# EAGLE design PILockbox_Zak_Jan_2016 (EAGLE 7.4.0)
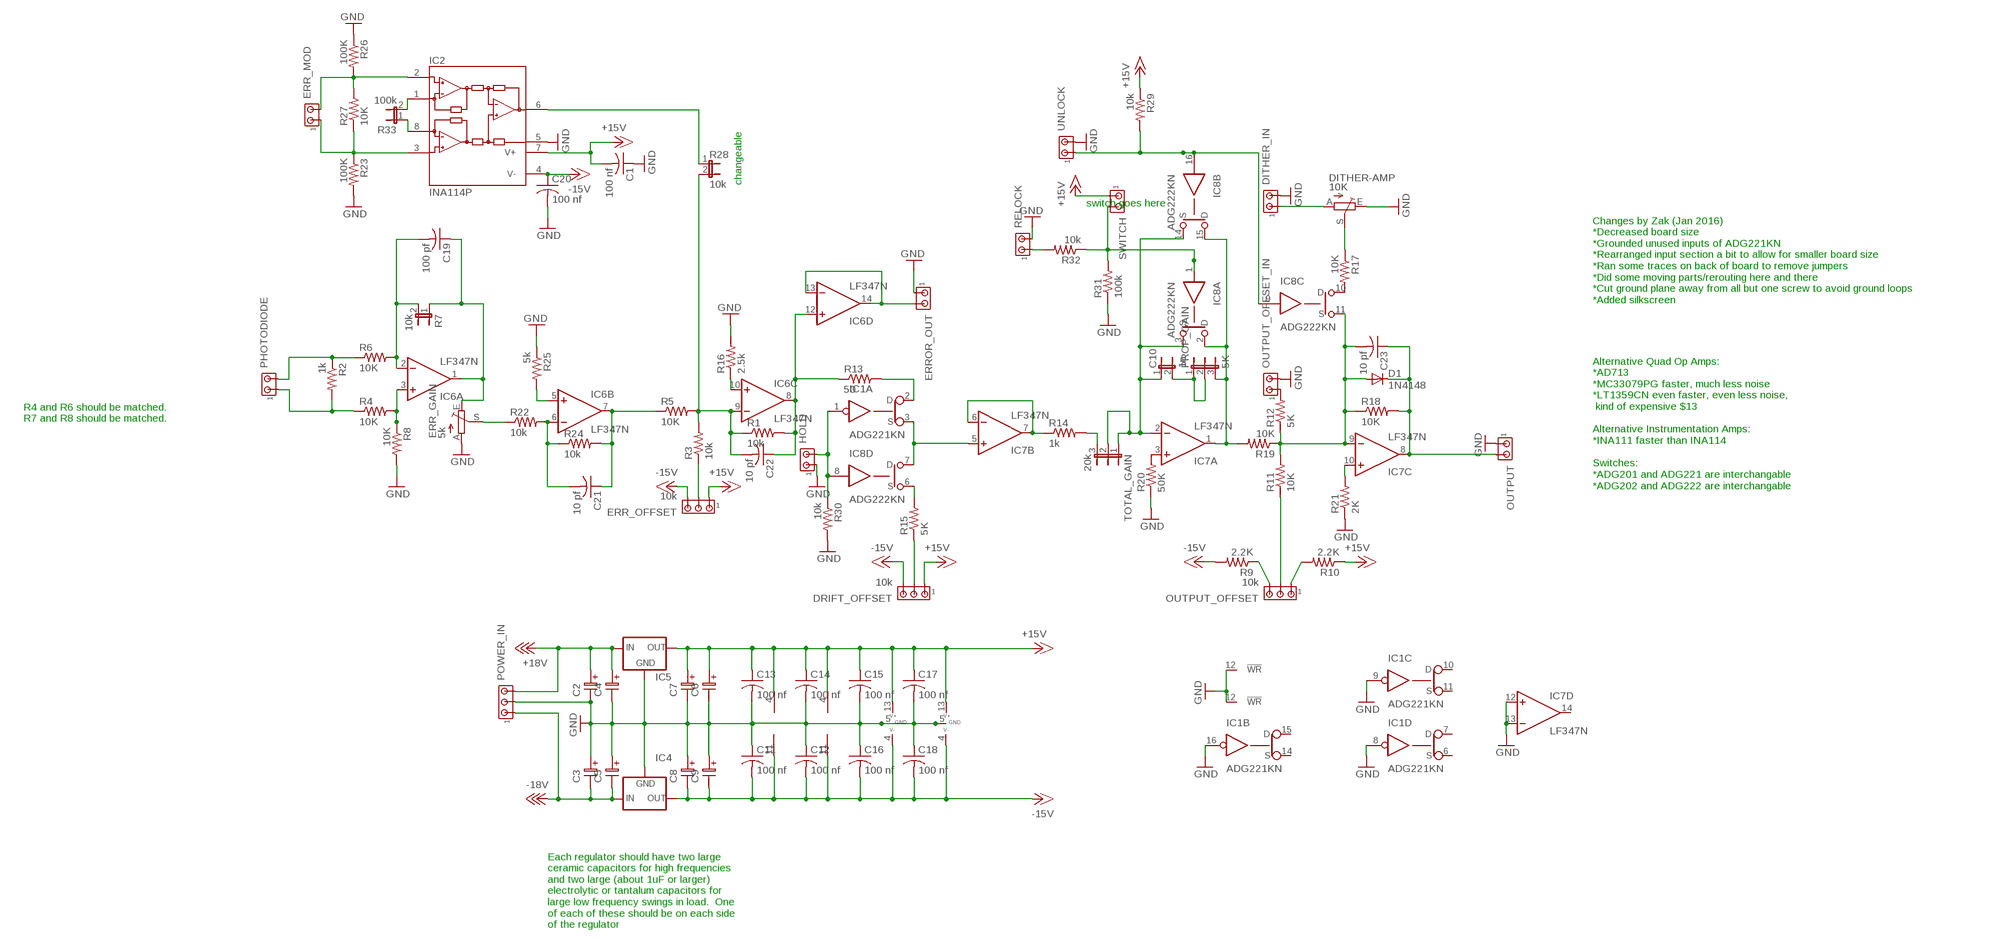
[diagram p0: schematic, sheet 1]

## Parts
C1  100 nf  C-USC0805  [C0805]
C2  ELC-2,5  [ES-2,5]
C3  ELC-2,5  [ES-2,5]
C4  ELC-2,5  [ES-2,5]
C5  ELC-2,5  [ES-2,5]
C6  ELC-2,5  [ES-2,5]
C7  ELC-2,5  [ES-2,5]
C8  ELC-2,5  [ES-2,5]
C9  ELC-2,5  [ES-2,5]
C10  1n  JP1E  [JP1]
C11  100 nf  C-USC0805  [C0805]
C12  100 nf  C-USC0805  [C0805]
C13  100 nf  C-USC0805  [C0805]
C14  100 nf  C-USC0805  [C0805]
C15  100 nf  C-USC0805  [C0805]
C16  100 nf  C-USC0805  [C0805]
C17  100 nf  C-USC0805  [C0805]
C18  100 nf  C-USC0805  [C0805]
C19  100 pf  C-USC0805  [C0805]
C20  100 nf  C-USC0805  [C0805]
C21  10 pf  C-USC0805  [C0805]
C22  10 pf  C-USC0805  [C0805]
C23  10 pf  C-USC0805  [C0805]
D1  1N4148  [DO35-10]
DITHER-AMP  10K  TRIM_EU-RJ9W  [RJ9W]
DITHER_IN  MTA02-100  [10X02MTA]
DRIFT_OFFSET  10k  MTA03-100  [10X03MTA]
ERR_GAIN  5k  TRIM_EU-RJ9W  [RJ9W]
ERR_MOD  MTA02-100  [10X02MTA]
ERR_OFFSET  10k  MTA03-100  [10X03MTA]
ERROR_OUT  MTA02-100  [10X02MTA]
HOLD  MTA02-100  [10X02MTA]
IC1  ADG221KN  [DIL16]
IC2  INA114P  [DIL08]
IC4  79XXL  [79XXL]
IC5  78XXL  [78XXL]
IC6  LF347N  [DIL14]
IC7  LF347N  [DIL14]
IC8  ADG222KN  [DIL16]
OUTPUT  MTA02-100  [10X02MTA]
OUTPUT_OFFSET  10k  MTA03-100  [10X03MTA]
OUTPUT_OFFSET_IN  MTA02-100  [10X02MTA]
PHOTODIODE  MTA02-100  [10X02MTA]
POWER_IN  MTA03-100  [10X03MTA]
PROP_GAIN  5K  JP2E  [JP2]
R1  10k  R-US_R1206  [R1206]
R2  1k  R-US_R1206  [R1206]
R3  10k  R-US_R1206  [R1206]
R4  10K  R-US_R1206  [R1206]
R5  10K  R-US_R1206  [R1206]
R6  10K  R-US_R1206  [R1206]
R7  10k  JP1E  [JP1]
R8  10K  R-US_R1206  [R1206]
R9  2.2K  R-US_R1206  [R1206]
R10  2.2K  R-US_R1206  [R1206]
R11  10K  R-US_R1206  [R1206]
R12  5K  R-US_R1206  [R1206]
R13  50  R-US_R1206  [R1206]
R14  1k  R-US_R1206  [R1206]
R15  5K  R-US_R1206  [R1206]
R16  2.5k  R-US_R1206  [R1206]
R17  10K  R-US_R1206  [R1206]
R18  10K  R-US_R1206  [R1206]
R19  10K  R-US_R1206  [R1206]
R20  50K  R-US_R1206  [R1206]
R21  2K  R-US_R1206  [R1206]
R22  10k  R-US_R1206  [R1206]
R23  100K  R-US_R1206  [R1206]
R24  10k  R-US_R1206  [R1206]
R25  5k  R-US_R1206  [R1206]
R26  100K  R-US_R1206  [R1206]
R27  10K  R-US_R1206  [R1206]
R28  10k  JP1E  [JP1]
R29  10k  R-US_R1206  [R1206]
R30  10k  R-US_R1206  [R1206]
R31  100k  R-US_R1206  [R1206]
R32  10k  R-US_R1206  [R1206]
R33  100k  JP1E  [JP1]
RELOCK  MTA02-100  [10X02MTA]
SWITCH  MTA02-100  [10X02MTA]
TOTAL_GAIN  20k  JP2E  [JP2]
UNLOCK  MTA02-100  [10X02MTA]

## Nets
+15V [+15V]: C1.2 C6.1 C7.1 C13.1 C14.1 C15.1 C17.1 DRIFT_OFFSET.1 ERR_OFFSET.1 IC1.13(P:V+) IC2.7(V+) IC5.OUT IC6.4(P:V+) IC7.4(P:V+) IC8.13(P:V+) R10.1 R29.1 SWITCH.1
+18V [+18V]: C2.1 C4.1 IC5.IN POWER_IN.3
-15V [-15V]: C8.2 C9.2 C11.2 C12.2 C16.2 C18.2 C20.1 DRIFT_OFFSET.3 ERR_OFFSET.3 IC1.4(P:V-) IC2.4(V-) IC4.OUT IC6.11(P:V-) IC7.11(P:V-) IC8.4(P:V-) R9.2
-18V [-18V]: C3.2 C5.2 IC4.IN POWER_IN.1
GND [GND]: C1.1 C2.2 C3.1 C4.2 C5.1 C6.2 C7.2 C8.1 C9.1 C11.1 C12.1 C13.2 C14.2 C15.2 C16.1 C17.2 C18.1 C20.2 DITHER-AMP.E DITHER_IN.2 ERR_GAIN.A ERROR_OUT.1 HOLD.1 IC1.5(P:GND) IC1.8(D:IN) IC1.9(C:IN) IC1.12(\WR:!WR) IC1.16(B:IN) IC2.5(REF) IC4.GND IC5.GND IC7.12(D:+IN) IC7.13(D:-IN) IC8.5(P:GND) IC8.12(\WR:!WR) OUTPUT.1 OUTPUT_OFFSET_IN.2 POWER_IN.2 R8.2 R16.2 R20.1 R21.1 R23.2 R25.1 R26.1 R30.2 R31.1 RELOCK.2 UNLOCK.2
N$1: IC6.3(A:+IN) R4.2 R8.1
N$2: C19.2 IC6.2(A:-IN) R6.2 R7.2
N$3: IC6.10(C:+IN) R16.1
N$4: ERROR_OUT.2 IC6.13(D:-IN) IC6.14(D:OUT)
N$5: PHOTODIODE.2 R2.1 R6.1
N$6: PHOTODIODE.1 R2.2 R4.1
N$7: C19.1 ERR_GAIN.E IC6.1(A:OUT) R7.1
N$8: IC1.3(A:S) IC7.5(B:+IN) IC8.7(D:D)
N$9: C22.2 IC6.9(C:-IN) R1.1 R3.2 R5.2 R28.2
N$10: ERR_OFFSET.2 R3.1
N$11: C22.1 IC6.8(C:OUT) IC6.12(D:+IN) R1.2 R13.1
N$12: IC1.2(A:D) R13.2
N$13: HOLD.2 IC1.1(A:IN) IC8.8(D:IN) R30.1
N$14: DRIFT_OFFSET.2 R15.1
N$15: IC8.6(D:S) R15.2
N$16: IC7.6(B:-IN) IC7.7(B:OUT) R14.1
N$17: R14.2 TOTAL_GAIN.3
N$18: C10.1 IC7.2(A:-IN) IC8.3(A:S) IC8.14(B:S) TOTAL_GAIN.1 TOTAL_GAIN.2
N$19: IC7.3(A:+IN) R20.2
N$20: C10.2 PROP_GAIN.1 PROP_GAIN.2
N$21: IC7.1(A:OUT) IC8.2(A:D) IC8.15(B:D) PROP_GAIN.3 R19.2
N$22: IC8.9(C:IN) IC8.16(B:IN) R29.2 UNLOCK.1
N$23: IC8.1(A:IN) R31.2 R32.1 SWITCH.2
N$24: C23.2 D1.A IC7.9(C:-IN) IC8.11(C:S) R11.2 R12.1 R18.1 R19.1
N$25: OUTPUT_OFFSET.3 R9.1
N$26: OUTPUT_OFFSET.1 R10.2
N$27: OUTPUT_OFFSET.2 R11.1
N$28: OUTPUT_OFFSET_IN.1 R12.2
N$29: DITHER-AMP.A DITHER_IN.1
N$30: IC2.6(OUT) R28.1
N$31: IC8.10(C:D) R17.2
N$32: IC7.10(C:+IN) R21.2
N$33: ERR_MOD.2 IC2.2(-IN) R26.2 R27.2
N$34: C23.1 D1.C IC7.8(C:OUT) OUTPUT.2 R18.2
N$35: ERR_MOD.1 IC2.3(+IN) R23.1 R27.1
N$36: ERR_GAIN.S R22.1
N$37: C21.1 IC6.7(B:OUT) R5.1 R24.2
N$38: C21.2 IC6.6(B:-IN) R22.2 R24.1
N$39: IC6.5(B:+IN) R25.2
N$40: R32.2 RELOCK.1
N$41: DITHER-AMP.S R17.1
N$43: IC2.1(RG) R33.2
N$44: IC2.8(RG) R33.1
Unconnected: IC1.6(D:S) IC1.7(D:D) IC1.10(C:D) IC1.11(C:S) IC1.14(B:S) IC1.15(B:D) IC7.14(D:OUT)

## Notes on the sheet
- changeable
- switch goes here
- Changes by Zak (Jan 2016)
  *Decreased board size
  *Grounded unused inputs of ADG221KN
  *Rearranged input section a bit to allow for smaller board size
  *Ran some traces on back of board to remove jumpers
  *Did some moving parts/rerouting here and there
  *Cut ground plane away from all but one screw to avoid ground loops
  *Added silkscreen
- Alternative Quad Op Amps:
  *AD713
  *MC33079PG faster, much less noise
  *LT1359CN even faster, even less noise,
   kind of expensive $13
  
  Alternative Instrumentation Amps:
  *INA111 faster than INA114
  
  Switches:
  *ADG201 and ADG221 are interchangable
  *ADG202 and ADG222 are interchangable
- R4 and R6 should be matched.
  R7 and R8 should be matched.
- Each regulator should have two large
  ceramic capacitors for high frequencies
  and two large (about 1uF or larger)
  electrolytic or tantalum capacitors for
  large low frequency swings in load.  One
  of each of these should be on each side
  of the regulator

## Library data of the parts
C1 C11-C23 = rcl:C-US: CAPACITOR, American symbol
C2-C9 = discrete:ELC-2,5
C10 R7 R28 R33 = jumper:JP1E: JUMPER
D1 = diode:1N4148: DIODE high speed (Philips)
DITHER-AMP ERR_GAIN = pot:TRIM_EU-: POTENTIOMETER
DITHER_IN ERR_MOD ERROR_OUT HOLD OUTPUT OUTPUT_OFFSET_IN PHOTODIODE RELOCK SWITCH UNLOCK = con-amp:MTA02-100: AMP connector
DRIFT_OFFSET ERR_OFFSET OUTPUT_OFFSET POWER_IN = con-amp:MTA03-100: AMP connector
IC1 = linear:ADG221K: CMOS SWITCH
IC2 = burr-brown:INA114: Precision Instrumentation Amplifier
IC4 = v-reg:79XXL: VOLTAGE REGULATOR
IC5 = v-reg:78XXL: VOLTAGE REGULATOR
IC6 IC7 = linear:LF347: OP AMP
IC8 = linear:ADG222K: CMOS SWITCH
PROP_GAIN TOTAL_GAIN = jumper:JP2E: JUMPER
R1-R6 R8-R27 R29-R32 = rcl:R-US_: RESISTOR, American symbol

## Net classes
1 GND: width 0.406 mm, drill 0.61 mm, clearance 0.178 mm
2 +15V: width 0.406 mm, drill 0.61 mm, clearance 0.178 mm
3 -15V: width 0.406 mm, drill 0.61 mm, clearance 0.178 mm
4 +18V: width 0.406 mm, drill 0.61 mm, clearance 0.178 mm
5 -18V: width 0.406 mm, drill 0.61 mm, clearance 0.61 mm

## Board
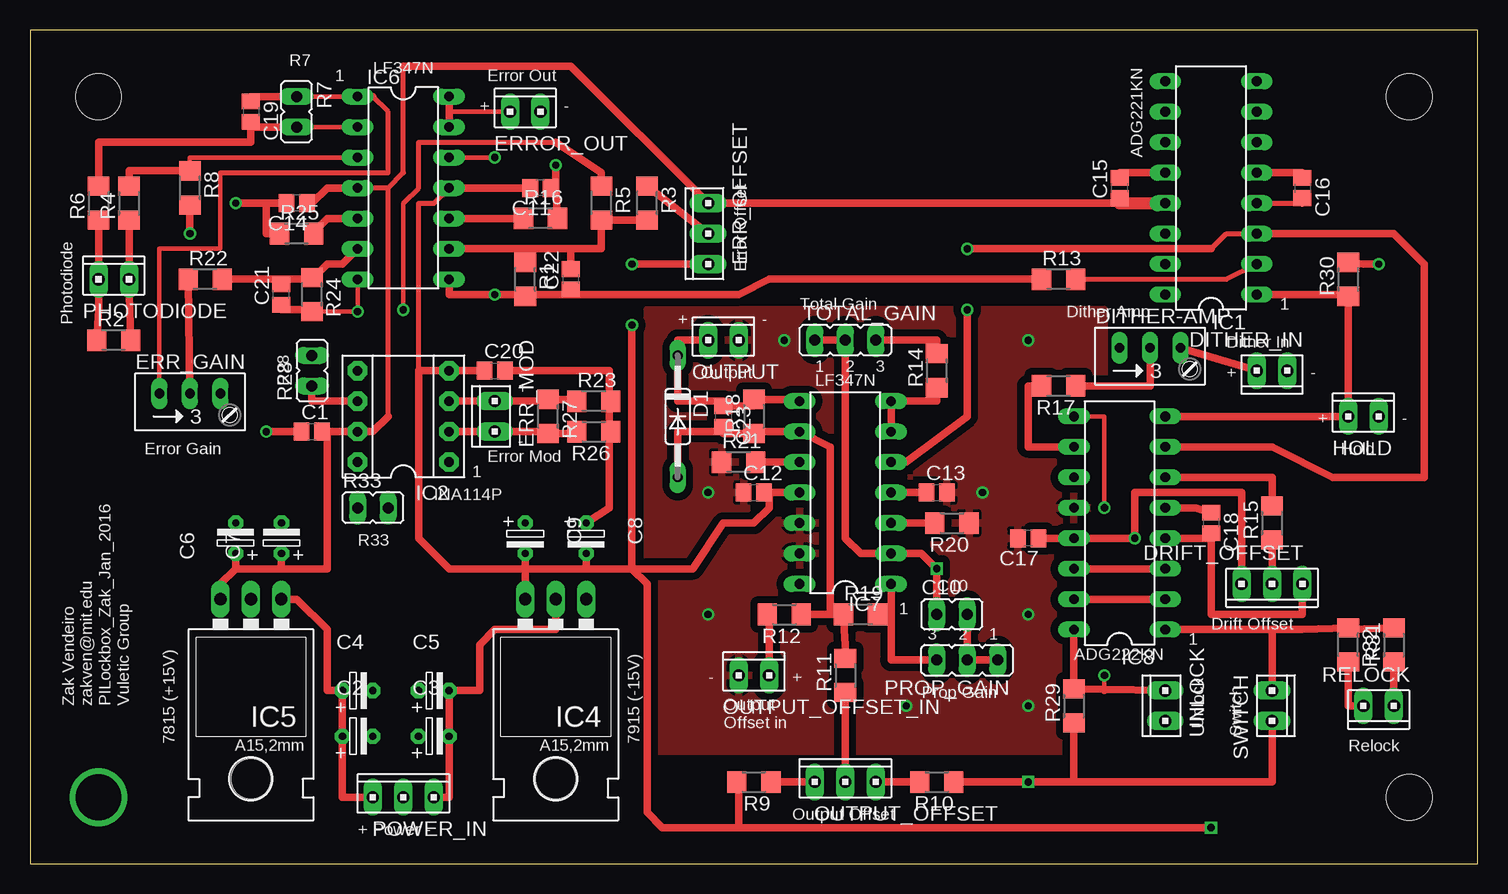
[diagram p1: board, top side]
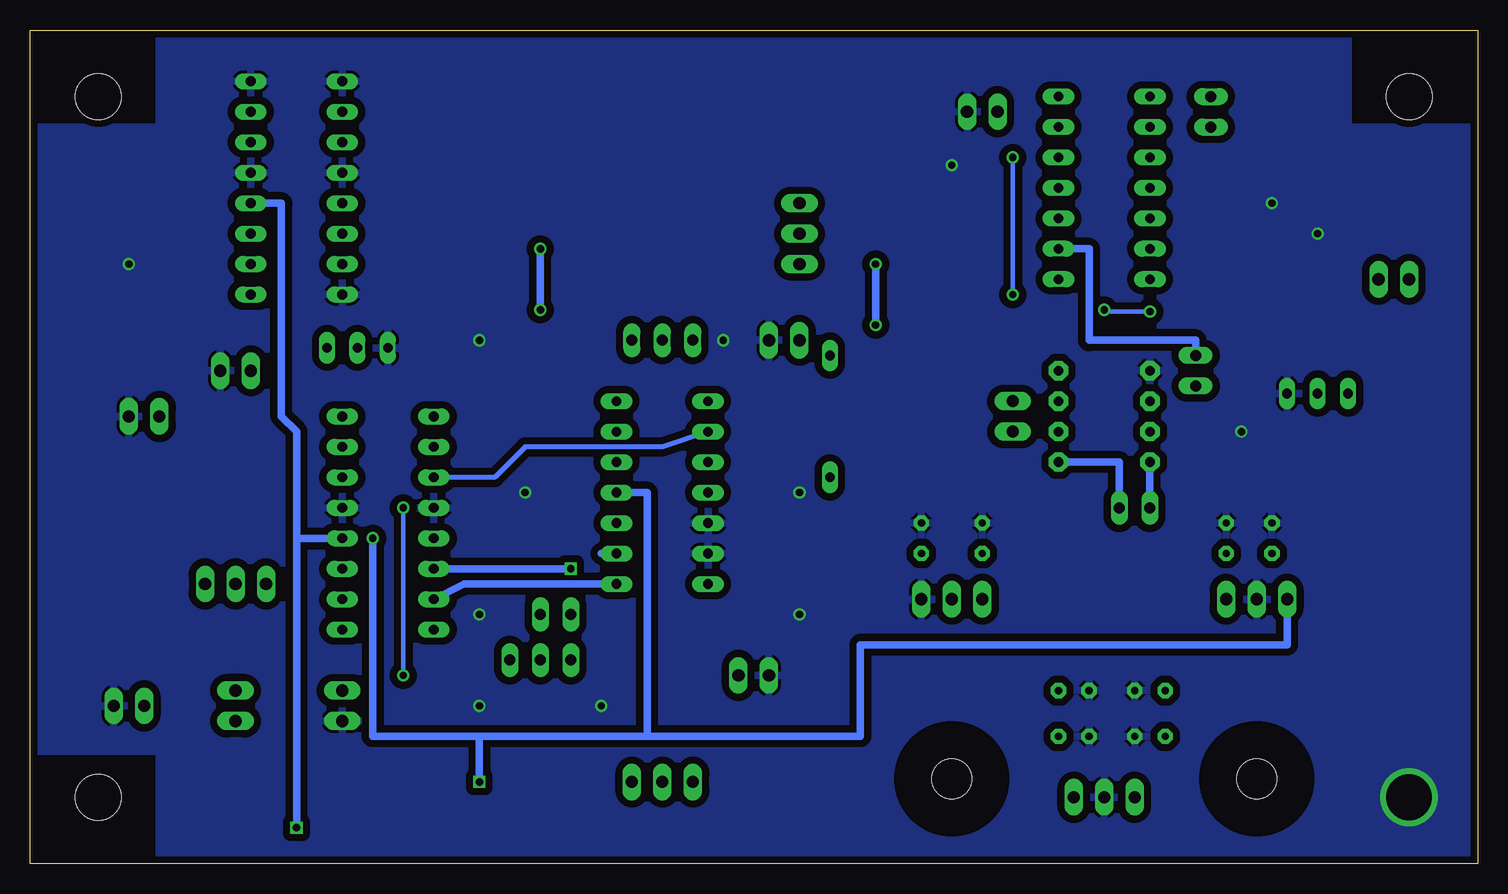
[diagram p2: board, bottom side, seen from below]

Size 120.63 x 69.52 mm. Coordinates in mm from the lower left corner, seen from the top.
Outline: 0,0 120.63,0 120.63,69.52 0,69.52 0,0
Copper layers (1*16): Top 0.035559375mm / dielectric 1.501140625mm / Bottom 0.035559375mm
Design rules "typical_4pcb": minimum track width 10mil, minimum drill 15mil, track to track 6mil, track to pad 6mil, pad to pad 6mil, via to via 6mil, smd to smd 6mil, copper to edge 15mil, drill to drill 8mil, minimum pad ring 10mil, minimum via ring 8mil, stop-mask expansion 4mil, vias tented up to drill 0mil, thermal gap 10mil
Holes 3.81 mm at 5.71,63.97 114.93,63.97 114.93,5.55

### Footprints (pad centres in the part's own frame; a part is rotated, then mirrored left to right if it is on the bottom)
C0805 = smd 1.3 x 1.5: 1 -0.85,0; 2 0.85,0
ES-2,5 = drill 0.61 pad 1.27 octagon: 1 -1.27,0; 2 1.27,0
JP1 = drill 0.914 long: 1 0,-1.27; 2 0,1.27
DO35-10 = drill 0.813 long: A 5.08,0; C -5.08,0
RJ9W = drill 0.813 long: A 2.54,0.635; E -2.54,0.635; S 0,0.635
10X02MTA = drill 1.016 long: 1 1.27,0; 2 -1.27,0
10X03MTA = drill 1.016 long: 1 2.54,0; 2 0,0; 3 -2.54,0
DIL16 = drill 0.813 long: 1 -8.89,-3.81; 2 -6.35,-3.81; 3 -3.81,-3.81; 4 -1.27,-3.81; 5 1.27,-3.81; 6 3.81,-3.81; 7 6.35,-3.81; 8 8.89,-3.81; 9 8.89,3.81; 10 6.35,3.81; 11 3.81,3.81; 12 1.27,3.81; 13 -1.27,3.81; 14 -3.81,3.81; 15 -6.35,3.81; 16 -8.89,3.81
DIL08 = drill 0.813 pad 1.6 octagon: 1 -3.81,-3.81; 2 -1.27,-3.81; 3 1.27,-3.81; 4 3.81,-3.81; 5 3.81,3.81; 6 1.27,3.81; 7 -1.27,3.81; 8 -3.81,3.81
79XXL = drill 1.016 long: GND -2.54,-3.81; IN 0,-3.81; OUT 2.54,-3.81 | hole 3.302: 0,11.176
78XXL = drill 1.016 long: GND 0,-3.81; IN -2.54,-3.81; OUT 2.54,-3.81 | hole 3.302: 0,11.176
DIL14 = drill 0.813 long: 1 -7.62,-3.81; 2 -5.08,-3.81; 3 -2.54,-3.81; 4 0,-3.81; 5 2.54,-3.81; 6 5.08,-3.81; 7 7.62,-3.81; 8 7.62,3.81; 9 5.08,3.81; 10 2.54,3.81; 11 0,3.81; 12 -2.54,3.81; 13 -5.08,3.81; 14 -7.62,3.81
JP2 = drill 0.914 long: 1 -2.54,0; 2 0,0; 3 2.54,0
R1206 = smd 1.6 x 1.803: 1 -1.422,0; 2 1.422,0

### Placement (x,y rotation side)
C1  23.49,36.03 0 top
C2  27.3,10.63 0 top
C3  33.65,10.63 0 top
C4  27.3,14.44 0 top
C5  33.65,14.44 0 top
C6  17.14,27.14 90 top
C7  20.95,27.14 90 top
C8  46.35,27.14 270 top
C9  41.27,27.14 270 top
C10  76.83,20.79 270 top
C11  42.54,56.35 180 top
C12  60.32,30.95 0 top
C13  75.56,30.95 0 top
C14  22.22,55.08 180 top
C15  90.8,56.35 90 top
C16  106.04,56.35 270 top
C17  83.18,27.14 180 top
C18  98.42,28.41 270 top
C19  18.41,62.7 270 top
C20  38.73,41.11 0 top
C21  20.95,47.46 90 top
C22  45.08,48.73 90 top
C23  57.78,37.3 270 top
D1  53.97,37.3 270 top
DITHER-AMP  93.34,42.38 0 top
DITHER_IN  103.5,41.11 180 top
DRIFT_OFFSET  103.5,23.33 180 top
ERR_GAIN  13.33,38.57 0 top
ERR_MOD  38.73,37.3 90 top
ERR_OFFSET  56.51,52.54 90 top
ERROR_OUT  41.27,62.7 0 top
HOLD  111.12,37.3 0 top
IC1  98.42,56.35 90 top
IC2  31.11,37.3 90 top
IC4  43.81,18.25 180 top
IC5  18.41,18.25 180 top
IC6  31.11,56.35 270 top
IC7  67.94,30.95 90 top
IC8  90.8,28.41 90 top
OUTPUT  57.78,43.65 0 top
OUTPUT_OFFSET  67.94,6.82 0 top
OUTPUT_OFFSET_IN  60.32,15.71 0 top
PHOTODIODE  6.98,48.73 0 top
POWER_IN  31.11,5.55 0 top
PROP_GAIN  78.1,16.98 180 top
R1  41.27,48.73 270 top
R2  6.98,43.65 0 top
R3  51.43,55.08 270 top
R4  8.25,55.08 90 top
R5  47.62,55.08 270 top
R6  5.71,55.08 90 top
R7  22.22,62.7 180 top
R8  13.33,56.35 270 top
R9  60.32,6.82 180 top
R10  75.56,6.82 180 top
R11  67.94,15.71 90 top
R12  62.86,20.79 180 top
R13  85.72,48.73 0 top
R14  75.56,41.11 90 top
R15  103.5,28.41 90 top
R16  42.54,53.81 0 top
R17  85.72,39.84 180 top
R18  60.32,37.3 90 top
R19  69.21,20.79 0 top
R20  76.83,28.41 180 top
R21  59.05,33.49 0 top
R22  14.6,48.73 0 top
R23  46.98,38.57 0 top
R24  23.49,47.46 270 top
R25  22.22,52.54 0 top
R26  46.98,36.03 180 top
R27  43.18,37.3 270 top
R28  23.49,41.11 0 top
R29  86.99,13.17 90 top
R30  109.85,48.73 90 top
R31  113.66,18.25 90 top
R32  109.85,18.25 270 top
R33  28.57,29.68 270 top
RELOCK  112.39,13.17 180 top
SWITCH  103.5,13.17 270 top
TOTAL_GAIN  67.94,43.65 0 top
UNLOCK  94.61,13.17 90 top

### Tracks (layer width: path | path; a pad name or v marks a point on that pad's centre or on a via)
+15V  (via drill 0.61)
  Top 0.406: 29.84,56.35 IC6.4 | 29.84,37.3 29.84,56.35 | 29.84,56.35 31.11,57.62 31.11,66.51 | C14.1 23.49,55.08
  Top 0.61: IC5.OUT 15.87,23.33 17.14,24.6 | 24.76,36.03 IC2.7 28.57,36.03 29.84,37.3 | 24.76,36.03 C1.2 | 31.11,66.51 45.08,66.51 ERR_OFFSET.1 90.8,55.08 | DRIFT_OFFSET.1 100.96,30.95 92.07,30.95 v92.07,27.14 IC8.13 C17.1 | 24.76,36.03 24.76,24.6 20.95,24.6 | IC6.4 24.76,56.35 23.49,55.08 | 17.14,24.6 20.95,24.6 | 76.83,6.82 R10.1 v83.18,6.82 85.72,6.82 86.99,6.82 | 86.99,6.82 103.5,6.82 SWITCH.1 | 17.14,24.6 C6.1 | 20.95,24.6 C7.1 | IC7.4 C13.1 | 86.99,6.82 R29.1
  Top 1.016: C15.1 90.8,55.08 IC1.13
  Bottom 0.61: IC5.OUT 15.87,18.25 51.43,18.25 51.43,10.63 69.21,10.63 | IC7.4 69.21,30.95 69.21,10.63 | 69.21,10.63 83.18,10.63 | 83.18,10.63 v83.18,6.82 | 83.18,10.63 92.07,10.63 v92.07,27.14
+18V
  Top 0.61: IC5.IN 22.22,22.06 24.76,19.52 24.76,14.44 C4.1 C2.1 26.03,5.55 POWER_IN.3
-15V  (via drill 0.61)
  Top 0.406: 32.38,41.11 32.38,55.08 33.65,55.08 IC6.11 | IC1.4 106.04,55.08 | C12.2 61.59,30.95
  Top 0.61: C20.1 IC2.4 32.38,41.11 32.38,27.14 34.92,24.6 41.27,24.6 | IC6.11 C11.2 | 50.16,24.6 51.43,23.33 51.43,4.28 52.7,3.01 59.05,3.01 | 41.27,24.6 IC4.OUT | 106.04,55.08 C16.2 | IC7.11 61.59,30.95 61.59,29.68 60.32,28.41 57.78,28.41 55.24,24.6 50.16,24.6 | R9.2 59.05,6.82 59.05,3.01 | 50.16,24.6 46.35,24.6 | 46.35,24.6 41.27,24.6 | 59.05,3.01 v98.42,3.01 | 41.27,24.6 C9.2 | 46.35,24.6 C8.2 | IC8.4 98,27.14 C18.2 98.42,20.79 106.04,20.79 DRIFT_OFFSET.3 | ERR_OFFSET.3 v50.16,50 | v50.16,44.92 50.16,24.6
  Bottom 0.61: 98.42,27.14 IC8.4 | v98.42,3.01 98.42,27.14 | IC1.4 99.69,55.08 99.69,37.3 98.42,36.03 98.42,27.14 | v50.16,50 v50.16,44.92
-18V
  Top 0.61: IC4.IN 43.81,19.52 38.73,19.52 37.46,18.25 37.46,14.44 C5.2 C3.2 34.92,5.55 POWER_IN.1
GND  (via drill 0.61, 0.61 pad 0.61, 3.81 pad 4.83)
  Top 0.61: 43.81,53.81 R16.2 43.81,56.35 | 19.68,55.08 v17.14,55.08 | 19.68,55.08 C14.2 | R25.1 19.68,52.54 19.68,55.08 | v19.68,36.03 C1.1 | RELOCK.2 R31.1 | v112.39,50 111.12,50 R30.2 | C18.1 97.15,29.68 IC8.5 | C16.1 106.04,57.62 IC1.5 | 43.81,56.35 v43.81,58.26 | 43.81,56.35 C11.1 | C20.2 48.26,41.11 48.26,38.57 | 48.26,38.57 R23.2 | 48.26,36.03 R26.1 | C8.1 48.26,29.68 48.26,36.03 | C15.2 90.8,57.62 IC1.12 | 48.26,36.03 48.26,38.57 | v13.33,52.54 R8.2
  other vias: 56.51,30.95 56.51,20.79 83.18,20.79 83.18,13.17 73.02,13.17 83.18,43.65 62.86,43.65 79.37,30.95 5.71,5.55
  pour Bottom (isolate 0.61): 0.63,61.43 10.79,61.43 10.79,69.05 109.85,69.05 109.85,61.43 120.01,61.43 120.01,9.36 109.85,9.36 109.85,0.47 0.63,0.47
  pour Top (isolate 0.61): 51.43,46.19 89.53,46.19 89.53,29.68 92.07,28.41 92.07,9.36 51.43,9.36
N$1
  Top 0.381: IC6.3 13.33,58.89 R8.1
  Top 0.61: R4.2 8.25,57.77 R8.1
N$2
  Top 0.381: IC6.2 R7.2
  Top 0.61: R6.2 5.71,60.16 18.41,60.16 18.41,61.43 | R7.2 18.41,61.43 | 18.41,61.43 C19.2
N$3
  Top 0.61: 41.27,53.81 R16.1 IC6.10
N$4
  Top 0.381: 34.92,62.7 ERROR_OUT.2
  Top 0.61: IC6.13 34.92,62.7 IC6.14
N$5
  Top 0.61: R6.1 PHOTODIODE.2 5.71,46.19 R2.1
N$6
  Top 0.61: R4.1 PHOTODIODE.1 8.25,47.46 R2.2
N$7
  Top 0.381: ERR_GAIN.E 10.79,51.27 15.87,51.27 15.87,57.62 | IC6.1 R7.1
  Top 0.406: 28.57,63.97 29.84,62.7 29.84,57.62 15.87,57.62
  Top 0.61: C19.1 18.41,63.97 R7.1 | 28.57,63.97 IC6.1
N$8  (via drill 0.61)
  Top 0.406: IC1.3 99.69,52.54 98.42,51.27
  Top 0.61: IC1.3 113.66,52.54 116.2,50 116.2,32.22 108.58,32.22 103.5,34.76 IC8.7 | IC7.5 73.02,33.49 78.1,37.3 v78.1,46.19 | v78.1,51.27 98.42,51.27
  Bottom 0.61: v78.1,46.19 v78.1,51.27
N$9
  Top 0.61: 41.27,50 R1.1 41.27,51.27 | IC6.9 41.27,51.27 | 45.08,51.27 C22.2 | 41.27,51.27 45.08,51.27 | 45.08,51.27 47.62,51.27 R5.2 R3.2
  Bottom 0.61: R28.2 23.49,43.65 32.38,43.65 32.38,51.27 IC6.9
N$10
  Top 0.61: R3.1 ERR_OFFSET.2
N$11  (via drill 0.61)
  Top 0.381: IC6.12 v38.73,58.89
  Top 0.61: 41.27,47.46 R1.2 | IC6.8 34.92,47.46 37.46,47.46 v38.73,47.46 41.27,47.46 | 41.27,47.46 45.08,47.46 | 45.08,47.46 C22.1 | 45.08,47.46 59.05,47.46 61.59,48.73 R13.1 83.18,48.73
  Bottom 0.381: v38.73,58.89 v38.73,47.46
N$12
  Top 0.406: R13.2 99.69,48.73 IC1.2
N$13
  Top 0.406: 109.85,47.46 R30.1
  Top 0.61: IC1.1 109.85,47.46 HOLD.2 IC8.8
N$14
  Top 0.61: DRIFT_OFFSET.2 R15.1
N$15
  Top 0.61: IC8.6 103.5,32.22 R15.2
N$16
  Top 0.61: IC7.6 IC7.7 75.56,38.57 R14.1
N$17
  Top 0.61: TOTAL_GAIN.3 75.56,43.65 R14.2
N$18  (via drill 0.61)
  Top 0.61: TOTAL_GAIN.1 TOTAL_GAIN.2 67.94,27.14 69.21,25.87 IC7.2 74.29,25.87 v75.56,24.6 C10.1 | IC8.14 IC8.3
  Bottom 0.61: IC7.2 73.02,25.87 | v75.56,24.6 IC8.14
N$19
  Top 0.61: 75.56,28.41 R20.2 IC7.3
N$20
  Top 0.61: C10.2 PROP_GAIN.2 PROP_GAIN.1
N$21
  Top 0.61: IC8.15 IC8.2 | 71.75,20.79 71.75,16.98 PROP_GAIN.3 | 71.75,20.79 IC7.1 | R19.2 71.75,20.79
  Bottom 0.61: IC7.1 84.45,23.33 IC8.15
N$22  (via drill 0.61)
  Top 0.381: IC8.9 89.53,37.3 v89.53,29.68 | v89.53,15.71 89.53,14.55
  Top 0.61: IC8.16 R29.2 89.53,14.55 | 89.53,14.55 UNLOCK.1 | 89.53,14.44 89.53,14.55
  Bottom 0.381: v89.53,29.68 v89.53,15.71
N$23
  Top 0.61: 103.5,19.52 SWITCH.2 | IC8.1 103.5,19.52 | 103.5,19.52 106.04,19.52 R32.1 109.85,19.52 R31.2
N$24
  Top 0.61: 57.78,36.03 57.78,35.88 R18.1 60.32,36.03 IC7.9 66.67,34.76 66.67,20.79 | D1.A 53.97,36.03 57.78,36.03 | 57.78,36.03 C23.2 | 64.13,20.79 R12.1 66.67,20.79 | R11.2 67.94,18.25 R19.1 66.67,20.79
  Bottom 0.406: IC7.9 67.94,34.76 79.37,34.76 81.91,32.22 IC8.11
N$25
  Top 0.61: R9.1 OUTPUT_OFFSET.3
N$26
  Top 0.61: OUTPUT_OFFSET.1 R10.2
N$27
  Top 0.61: OUTPUT_OFFSET.2 R11.1
N$28
  Top 0.61: R12.2 61.59,20.79 OUTPUT_OFFSET_IN.1
N$29
  Top 0.61: DITHER-AMP.A DITHER_IN.1
N$30
  Top 0.61: R28.1 23.49,38.57 IC2.6
N$31
  Top 0.61: IC8.10 83.18,34.76 83.18,39.84 R17.2
N$32
  Top 0.61: R21.2 IC7.10
N$33
  Top 0.61: IC2.2 ERR_MOD.2 42.54,36.03 R27.2 45.08,35.88 45.08,36.03 R26.2
N$34
  Top 0.61: IC7.8 64.13,38.72 R18.2 60.32,38.15 C23.1 57.78,38.57 53.97,38.57 D1.C 53.97,43.65 OUTPUT.2
N$35
  Top 0.61: IC2.3 ERR_MOD.1 42.54,38.57 R27.1 45.08,38.72 45.08,38.57 R23.1
N$36
  Top 0.61: ERR_GAIN.S R22.1
N$37  (via drill 0.61)
  Top 0.381: IC6.7 v27.3,46.04 R24.2 | 31.11,55.08 v31.11,46.19
  Top 0.406: 43.81,60.16 32.38,60.16 32.38,56.35 31.11,55.08
  Top 0.61: C21.1 20.95,46.19 23.49,46.19 R24.2 | 47.62,56.35 R5.1 47.62,57.62 43.81,60.16
  Bottom 0.381: v31.11,46.19 31.11,46.04 v27.3,46.04
N$38
  Top 0.61: 23.49,48.73 R24.1 | 20.95,48.73 23.49,48.73 | 20.95,48.73 C21.2 | 20.95,48.73 19.68,48.73 R22.2 | IC6.6 26.03,50 24.76,50 23.49,48.73
N$39
  Top 0.254: 23.49,52.54 R25.2
  Top 0.61: IC6.5 24.76,53.81 23.49,52.54
N$40
  Top 0.61: R32.2 109.85,13.17 RELOCK.1
N$41
  Top 0.61: DITHER-AMP.S 93.34,39.84 R17.1
N$43
  Bottom 0.61: R33.2 29.84,33.49 IC2.1
N$44
  Bottom 0.61: R33.1 IC2.8

### Text on the board
tPlace: R7 | LF347N | 1 | Error Out | + | - | ADG221KN | Photodiode | Error Offset | Total Gain | 1 | + | - | Dither Amp | Dither In | R28 | Output | LF347N | + | - | + | + | - | - | Error Gain | Hold | Error Mod | 1 | INA114P | R33 | C10 | 1 | Drift Offset | 1 | ADG222KN | - | + | Prop Gain | Zak Vendeiro / zakven@mit.edu / PILockbox_Zak_Jan_2016 / Vuletic Group | Output / Offset in | Unlock | 7815 (+15V) | 7915 (-15V) | Switch | Relock | Output Offset | + Power -
Reference: TOP